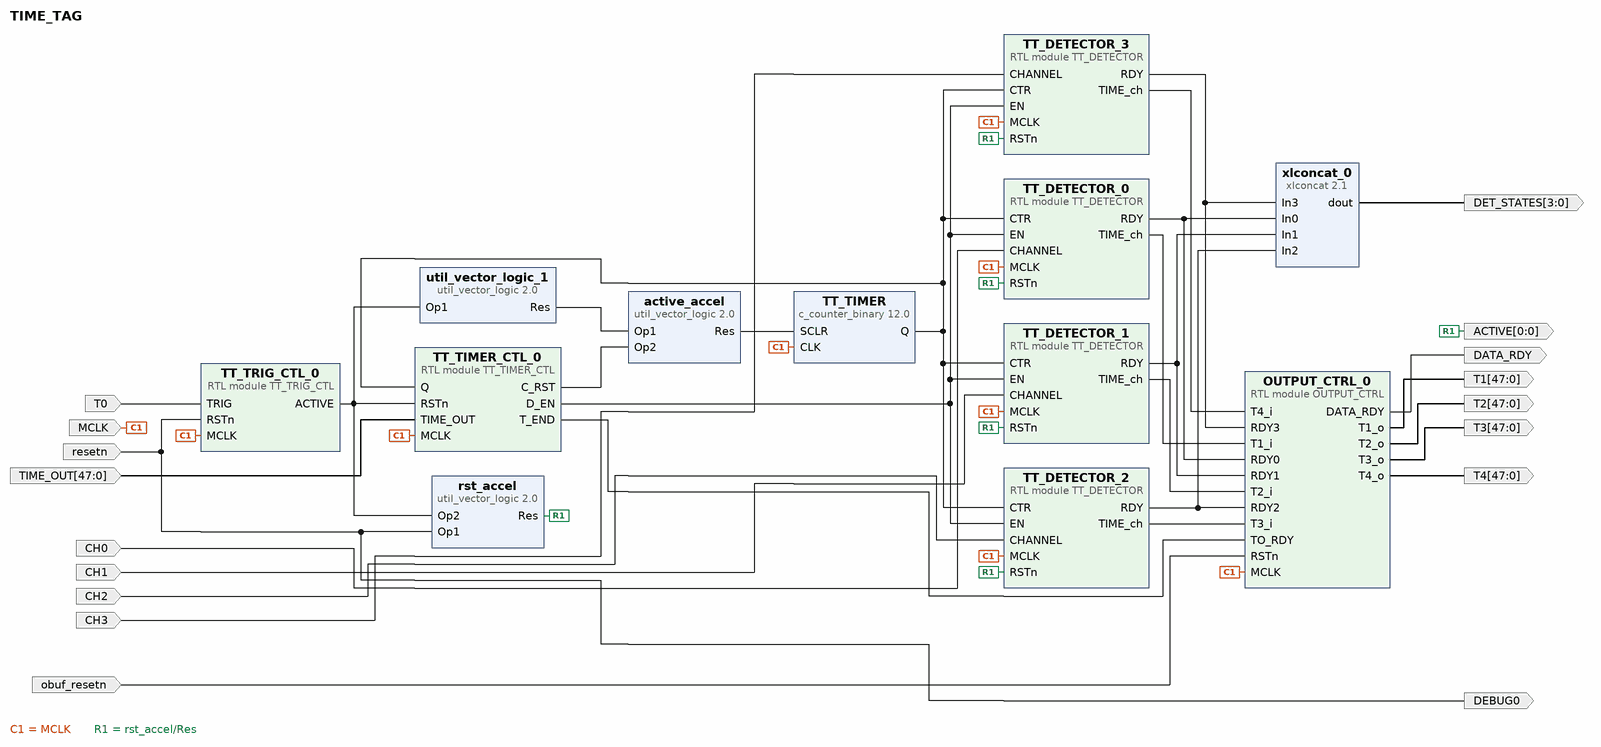
[diagram p0: block diagram of the top level]
# Vivado block design TIME_TAG, xc7z020clg400-1, Vivado 2019.1
create_bd_design TIME_TAG

create_bd_port -dir I CH0
create_bd_port -dir I resetn
create_bd_port -dir I CH1
create_bd_port -dir I CH2
create_bd_port -dir I CH3
create_bd_port -dir I T0
create_bd_port -dir I MCLK
create_bd_port -dir I -from 47 -to 0 TIME_OUT
create_bd_port -dir O DATA_RDY
create_bd_port -dir O -from 3 -to 0 DET_STATES
create_bd_port -dir O -from 47 -to 0 T1
create_bd_port -dir O -from 47 -to 0 T2
create_bd_port -dir O -from 47 -to 0 T3
create_bd_port -dir O -from 47 -to 0 T4
create_bd_port -dir I obuf_resetn
create_bd_port -dir O -from 0 -to 0 ACTIVE
create_bd_port -dir O DEBUG0

create_bd_cell -type ip -vlnv xilinx.com:ip:c_counter_binary:12.0 TT_TIMER
set_property -dict {CONFIG.CE false CONFIG.Output_Width 48 CONFIG.SCLR true} [get_bd_cells TT_TIMER]
create_bd_cell -type module -reference TT_TRIG_CTL TT_TRIG_CTL_0
create_bd_cell -type ip -vlnv xilinx.com:ip:xlconcat:2.1 xlconcat_0
set_property -dict {CONFIG.NUM_PORTS 4} [get_bd_cells xlconcat_0]
create_bd_cell -type module -reference TT_DETECTOR TT_DETECTOR_0
create_bd_cell -type module -reference TT_DETECTOR TT_DETECTOR_1
create_bd_cell -type module -reference TT_DETECTOR TT_DETECTOR_2
create_bd_cell -type module -reference TT_DETECTOR TT_DETECTOR_3
create_bd_cell -type module -reference TT_TIMER_CTL TT_TIMER_CTL_0
create_bd_cell -type module -reference OUTPUT_CTRL OUTPUT_CTRL_0
create_bd_cell -type ip -vlnv xilinx.com:ip:util_vector_logic:2.0 active_accel
set_property -dict {CONFIG.C_OPERATION and CONFIG.C_SIZE 1} [get_bd_cells active_accel]
create_bd_cell -type ip -vlnv xilinx.com:ip:util_vector_logic:2.0 util_vector_logic_1
set_property -dict {CONFIG.C_OPERATION not CONFIG.C_SIZE 1} [get_bd_cells util_vector_logic_1]
create_bd_cell -type ip -vlnv xilinx.com:ip:util_vector_logic:2.0 rst_accel
set_property -dict {CONFIG.C_OPERATION and CONFIG.C_SIZE 1} [get_bd_cells rst_accel]

# ---- connections ----

connect_bd_net -net T0_1 [get_bd_ports T0] [get_bd_pins TT_TRIG_CTL_0/TRIG]
connect_bd_net [get_bd_ports MCLK] \
  [get_bd_pins TT_TRIG_CTL_0/MCLK] [get_bd_pins TT_TIMER/CLK] [get_bd_pins TT_DETECTOR_0/MCLK] \
  [get_bd_pins TT_DETECTOR_1/MCLK] [get_bd_pins TT_DETECTOR_2/MCLK] [get_bd_pins TT_DETECTOR_3/MCLK] \
  [get_bd_pins TT_TIMER_CTL_0/MCLK] [get_bd_pins OUTPUT_CTRL_0/MCLK]
connect_bd_net -net RSTn_1 [get_bd_ports resetn] [get_bd_pins TT_TRIG_CTL_0/RSTn] [get_bd_pins rst_accel/Op1] [get_bd_ports DEBUG0]
connect_bd_net [get_bd_pins TT_TRIG_CTL_0/ACTIVE] [get_bd_pins TT_TIMER_CTL_0/RSTn] [get_bd_pins util_vector_logic_1/Op1] [get_bd_pins rst_accel/Op2]
connect_bd_net -net CH0_1 [get_bd_ports CH0] [get_bd_pins TT_DETECTOR_0/CHANNEL]
connect_bd_net [get_bd_pins TT_TIMER/Q] \
  [get_bd_pins TT_DETECTOR_0/CTR] [get_bd_pins TT_DETECTOR_1/CTR] [get_bd_pins TT_DETECTOR_2/CTR] \
  [get_bd_pins TT_DETECTOR_3/CTR] [get_bd_pins TT_TIMER_CTL_0/Q]
connect_bd_net [get_bd_pins TT_TIMER_CTL_0/D_EN] \
  [get_bd_pins TT_DETECTOR_0/EN] [get_bd_pins TT_DETECTOR_1/EN] [get_bd_pins TT_DETECTOR_2/EN] [get_bd_pins TT_DETECTOR_3/EN]
connect_bd_net [get_bd_pins TT_TIMER_CTL_0/C_RST] [get_bd_pins active_accel/Op2]
connect_bd_net [get_bd_ports TIME_OUT] [get_bd_pins TT_TIMER_CTL_0/TIME_OUT]
connect_bd_net [get_bd_pins TT_TIMER_CTL_0/T_END] [get_bd_pins OUTPUT_CTRL_0/TO_RDY]
connect_bd_net [get_bd_pins OUTPUT_CTRL_0/DATA_RDY] [get_bd_ports DATA_RDY]
connect_bd_net [get_bd_pins TT_DETECTOR_0/RDY] [get_bd_pins xlconcat_0/In0] [get_bd_pins OUTPUT_CTRL_0/RDY0]
connect_bd_net [get_bd_pins xlconcat_0/dout] [get_bd_ports DET_STATES]
connect_bd_net -net CH1_1 [get_bd_ports CH1] [get_bd_pins TT_DETECTOR_1/CHANNEL]
connect_bd_net -net CH2_1 [get_bd_ports CH2] [get_bd_pins TT_DETECTOR_2/CHANNEL]
connect_bd_net -net CH3_1 [get_bd_ports CH3] [get_bd_pins TT_DETECTOR_3/CHANNEL]
connect_bd_net [get_bd_pins TT_DETECTOR_1/RDY] [get_bd_pins xlconcat_0/In1] [get_bd_pins OUTPUT_CTRL_0/RDY1]
connect_bd_net [get_bd_pins TT_DETECTOR_2/RDY] [get_bd_pins xlconcat_0/In2] [get_bd_pins OUTPUT_CTRL_0/RDY2]
connect_bd_net [get_bd_pins TT_DETECTOR_3/RDY] [get_bd_pins xlconcat_0/In3] [get_bd_pins OUTPUT_CTRL_0/RDY3]
connect_bd_net -net OBUF_RST_1 [get_bd_ports obuf_resetn] [get_bd_pins OUTPUT_CTRL_0/RSTn]
connect_bd_net [get_bd_pins TT_DETECTOR_0/TIME_ch] [get_bd_pins OUTPUT_CTRL_0/T1_i]
connect_bd_net [get_bd_pins TT_DETECTOR_1/TIME_ch] [get_bd_pins OUTPUT_CTRL_0/T2_i]
connect_bd_net [get_bd_pins TT_DETECTOR_2/TIME_ch] [get_bd_pins OUTPUT_CTRL_0/T3_i]
connect_bd_net [get_bd_pins TT_DETECTOR_3/TIME_ch] [get_bd_pins OUTPUT_CTRL_0/T4_i]
connect_bd_net [get_bd_pins OUTPUT_CTRL_0/T1_o] [get_bd_ports T1]
connect_bd_net [get_bd_pins OUTPUT_CTRL_0/T2_o] [get_bd_ports T2]
connect_bd_net [get_bd_pins OUTPUT_CTRL_0/T3_o] [get_bd_ports T3]
connect_bd_net [get_bd_pins OUTPUT_CTRL_0/T4_o] [get_bd_ports T4]
connect_bd_net [get_bd_pins util_vector_logic_1/Res] [get_bd_pins active_accel/Op1]
connect_bd_net -net util_vector_logic_0_Res [get_bd_pins active_accel/Res] [get_bd_pins TT_TIMER/SCLR]
connect_bd_net [get_bd_pins rst_accel/Res] \
  [get_bd_pins TT_DETECTOR_3/RSTn] [get_bd_pins TT_DETECTOR_2/RSTn] [get_bd_pins TT_DETECTOR_1/RSTn] \
  [get_bd_pins TT_DETECTOR_0/RSTn] [get_bd_ports ACTIVE]

validate_bd_design
save_bd_design
